# Altium schematic sheet Simple RC Circuit.schdoc: Simple RC Circuit
size A4; Organization: Altium Limited; Address1: L3, 12a Rodborough Rd; Address2: Frenchs Forest; Address3: NSW; Address4: Australia 2086; DocumentNumber: 1; SheetNumber: 1; SheetTotal: 1
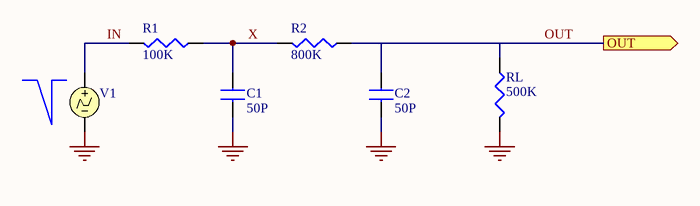
[diagram p0: Simple RC Circuit.schdoc]

## Parts
C1  50P
C2  50P
R1  100K
R2  800K
RL  500K
V1  VPWL  (value not drawn)

## Ports
OUT (out)

## Nets
GND: C1.2 C2.2 RL.1(TOP) V1.2
IN: R1.1(TOP) V1.1
OUT: C2.1 R2.2(BOT) RL.2(BOT) ; port OUT
X: C1.1 R1.2(BOT) R2.1(TOP)

## Notes on the sheet
- Title
- Size:
- Date:
- A4
- Number:
- Time:
- Revision:
- Sheet
- of
- File:

## Library data of the parts
C1 C2 = CAP: Capacitor; Value: 50P
R1 R2 RL = RES: Resistor
  R1: Value: 100K
  R2: Value: 800K
  RL: Value: 500K
V1 = VPWL: Piecewise Linear Voltage Source; Time-Value Pairs: 0 5 5U 5 12U 0 50U 5 60U 5; File Name: *